# EAGLE board LRC (EAGLE 5.11)
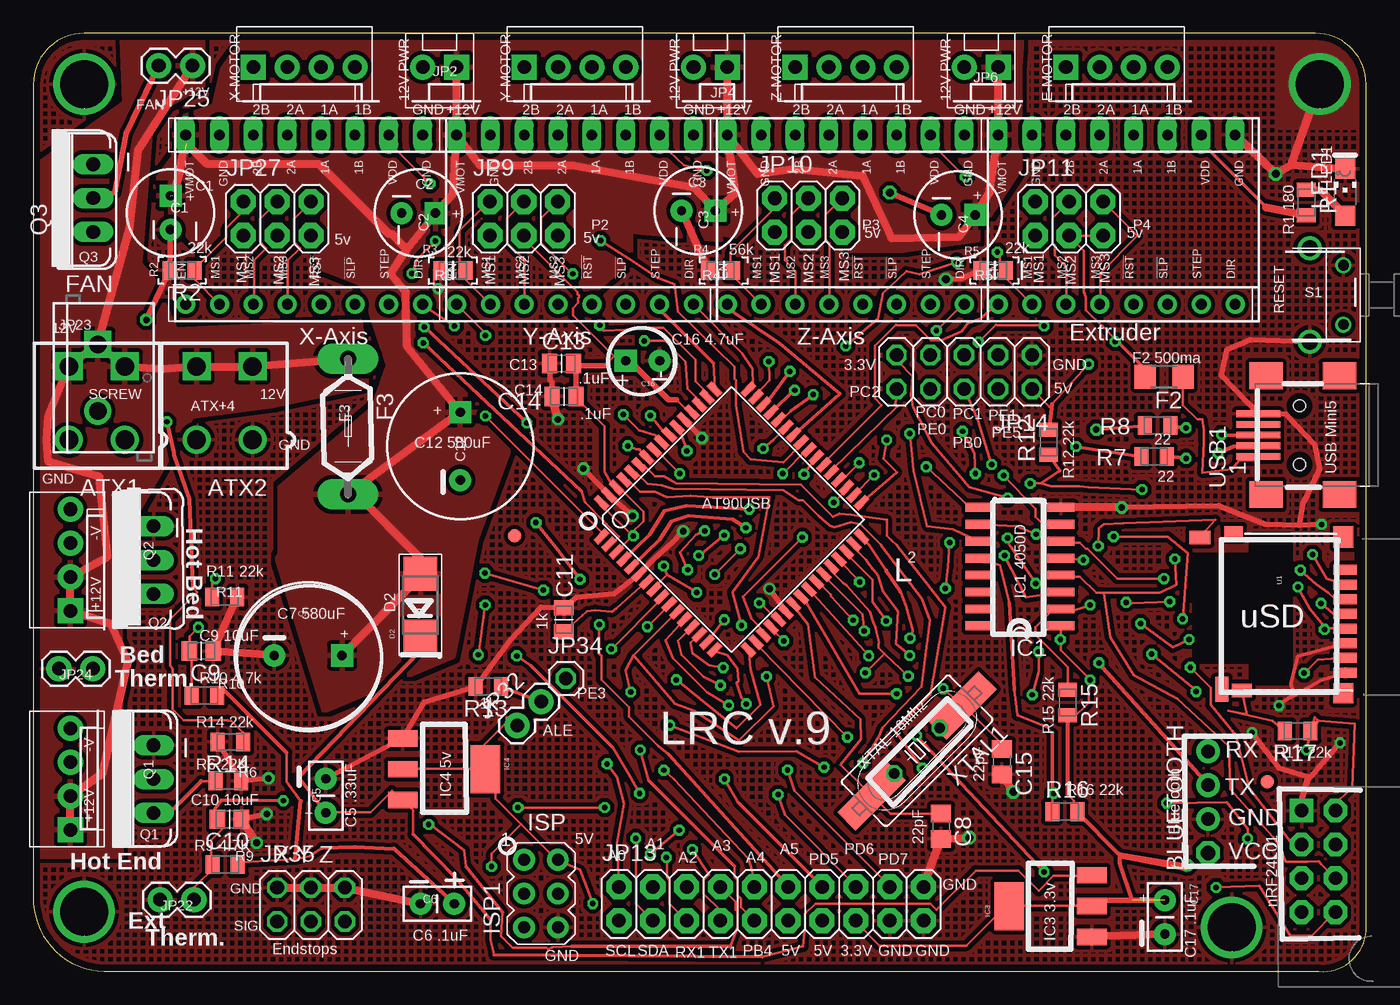
[diagram p1: board, top side]
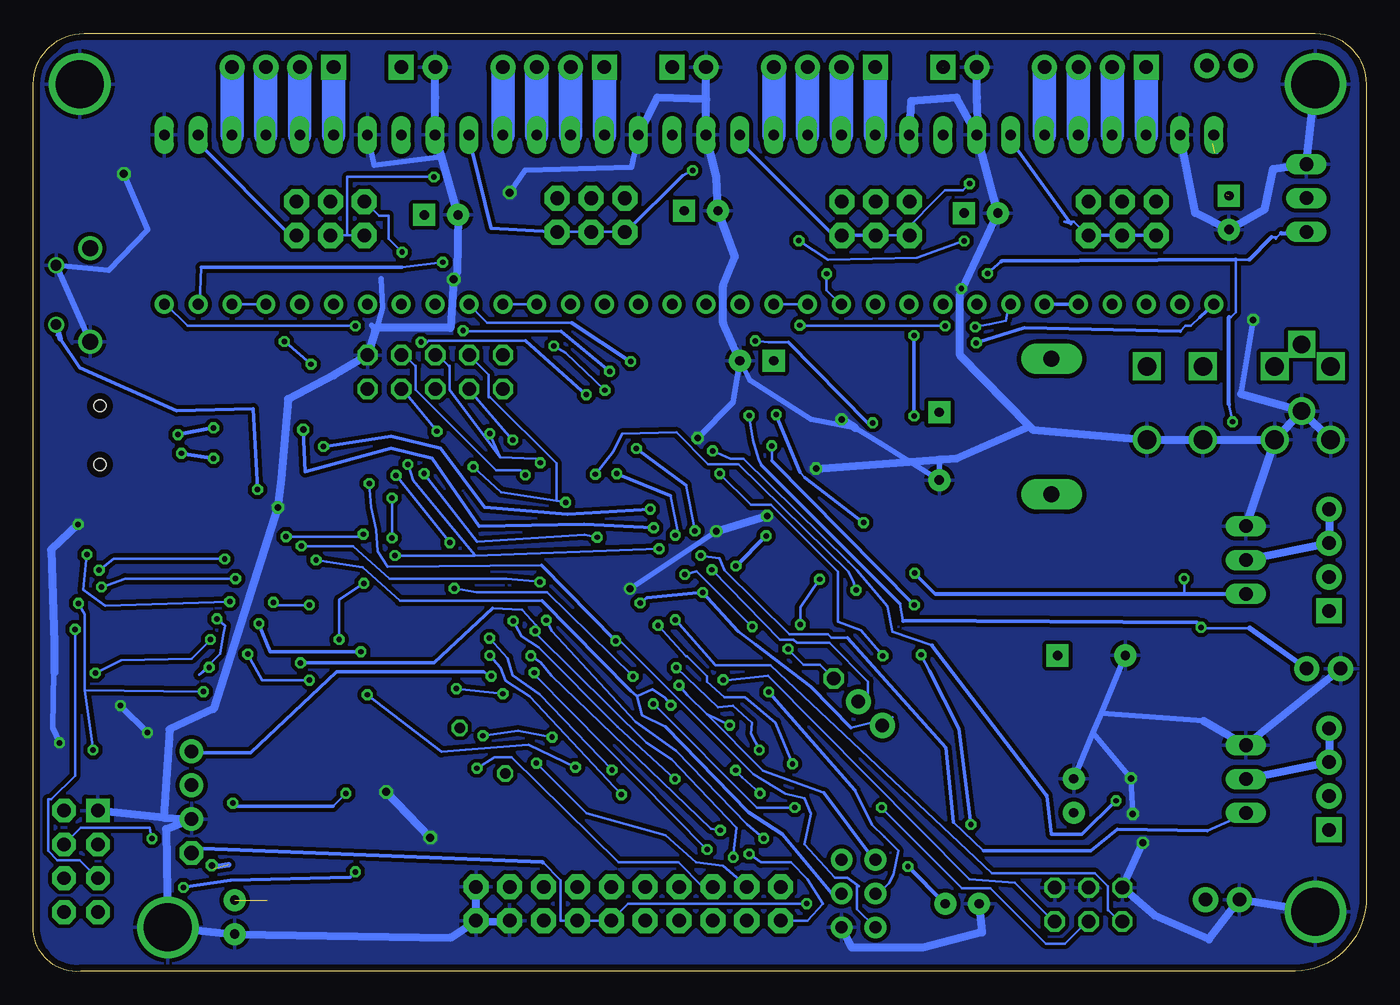
[diagram p2: board, bottom side, seen from below]

Size 100 x 70.37 mm. Coordinates in mm from the lower left corner, seen from the top.
Outline: 0,5.6 arc90 5.33,0.01 96.46,0.01 arc90 100,3.06 100,66.56 arc90 96.19,70.37 3.81,70.37 arc90 0,66.56 0,5.6
Copper layers (1*16): Top 0.0356mm / dielectric 1.5011mm / Bottom 0.0356mm
Design rules "LaenPCBOrder-LL-strict": minimum track width 8mil, minimum drill 16mil, track to track 8mil, track to pad 8mil, pad to pad 12mil, via to via 10mil, smd to smd 4mil, copper to edge 20mil, drill to drill 15mil, minimum pad ring 8mil, minimum via ring 8mil, stop-mask expansion 6mil, vias tented up to drill 25mil, thermal gap 12mil

## Footprints (pad centres in the part's own frame; a part is rotated, then mirrored left to right if it is on the bottom)
MINIFITJR-4-VERTICAL = drill 1.4 round: 1 2.1,-2.75; 2 -2.1,-2.75 | drill 1.4 square: 3 2.1,2.75; 4 -2.1,2.75
BLUETOOTH-BREAKOUT1X04 = drill 1.016 pad 1.778 round: GND 0,-1.27; RX 0,3.81; TX 0,1.27 | drill 1.1 pad 1.778 octagon: VCC 0,-3.81
CPOL-RADIAL-100UF-25V = drill 0.7 pad 1.651 square: 1 1.27,0 | drill 0.7 pad 1.651 round: 2 -1.27,0
CAP-PTH-SMALL2 = drill 0.7 pad 1.651 round: 1 0,0; 2 2.54,0
CPOL-RADIAL-1000UF-25V = drill 0.7 pad 1.651 square: 1 2.54,0 | drill 0.7 pad 1.651 round: 2 -2.54,0
C805 = smd 1.3 x 1.5: 1 -0.95,0; 2 0.95,0
CAPC2012X145AN = smd 1.15 x 1.45: 1 -0.9,0; 2 0.9,0
CPOL-RADIAL-10UF-25V = drill 0.7 pad 1.651 square: 1 1.27,0 | drill 0.7 pad 1.651 round: 2 -1.27,0
SMADIODE = smd 2.54 x 2.54: A 2.349,0; C -2.349,0
R1206 = smd 1.6 x 1.803: 1 -1.422,0; 2 1.422,0
LITTLEFUSE = drill 1.2 pad 2.3 long: 1 -5.08,0; 2 5.08,0
SO16 = smd 0.66 x 2.032: 1 -4.445,-3.073; 2 -3.175,-3.073; 3 -1.905,-3.073; 4 -0.635,-3.073; 5 0.635,-3.073; 6 1.905,-3.073; 7 3.175,-3.073; 8 4.445,-3.073; 9 4.445,3.073; 10 3.175,3.073; 11 1.905,3.073; 12 0.635,3.073; 13 -0.635,3.073; 14 -1.905,3.073; 15 -3.175,3.073; 16 -4.445,3.073
TQFP64-2 = smd 1.194 x 0.508: 1 -7.8,6; 2 -7.8,5.2; 3 -7.8,4.4; 4 -7.8,3.6; 5 -7.8,2.8; 6 -7.8,2; 7 -7.8,1.2; 8 -7.8,0.4; 9 -7.8,-0.4; 10 -7.8,-1.2; 11 -7.8,-2; 12 -7.8,-2.8; 13 -7.8,-3.6; 14 -7.8,-4.4; 15 -7.8,-5.2; 16 -7.8,-6; 33 7.8,-6; 34 7.8,-5.2; 35 7.8,-4.4; 36 7.8,-3.6; 37 7.8,-2.8; 38 7.8,-2; 39 7.8,-1.2; 40 7.8,-0.4; 41 7.8,0.4; 42 7.8,1.2; 43 7.8,2; 44 7.8,2.8; 45 7.8,3.6; 46 7.8,4.4; 47 7.8,5.2; 48 7.8,6 | smd 0.508 x 1.194: 17 -6,-7.8; 18 -5.2,-7.8; 19 -4.4,-7.8; 20 -3.6,-7.8; 21 -2.8,-7.8; 22 -2,-7.8; 23 -1.2,-7.8; 24 -0.4,-7.8; 25 0.4,-7.8; 26 1.2,-7.8; 27 2,-7.8; 28 2.8,-7.8; 29 3.6,-7.8; 30 4.4,-7.8; 31 5.2,-7.8; 32 6,-7.8; 49 6,7.8; 50 5.2,7.8; 51 4.4,7.8; 52 3.6,7.8; 53 2.8,7.8; 54 2,7.8; 55 1.2,7.8; 56 0.4,7.8; 57 -0.4,7.8; 58 -1.2,7.8; 59 -2,7.8; 60 -2.8,7.8; 61 -3.6,7.8; 62 -4.4,7.8; 63 -5.2,7.8; 64 -6,7.8
SOT223 = smd 1.219 x 2.235: 1 -2.311,-3.099; 2 0,-3.099; 3 2.311,-3.099 | smd 3.6 x 2.2: 4 0,3.099
AVRISP = drill 0.9 pad 1.626 round: 1 -1.27,2.54; 2 1.27,2.54; 3 -1.27,0; 4 1.27,0; 5 -1.27,-2.54; 6 1.27,-2.54
MOLEX-1X4 = drill 1.016 pad 1.88 square: 1 0,0 | drill 1.016 pad 1.88 round: 2 2.54,0; 3 5.08,0; 4 7.62,0
MOLEX-1X2 = drill 1.016 pad 1.88 square: 1 0,0 | drill 1.016 pad 1.88 round: 2 2.54,0
2X03 = drill 1.016 pad 1.88 octagon: 1 -2.54,-1.27; 2 -2.54,1.27; 3 0,-1.27; 4 0,1.27; 5 2.54,-1.27; 6 2.54,1.27
2X10 = drill 1.016 pad 1.88 octagon: 1 -11.43,-1.27; 2 -11.43,1.27; 3 -8.89,-1.27; 4 -8.89,1.27; 5 -6.35,-1.27; 6 -6.35,1.27; 7 -3.81,-1.27; 8 -3.81,1.27; 9 -1.27,-1.27; 10 -1.27,1.27; 11 1.27,-1.27; 12 1.27,1.27; 13 3.81,-1.27; 14 3.81,1.27; 15 6.35,-1.27; 16 6.35,1.27; 17 8.89,-1.27; 18 8.89,1.27; 19 11.43,-1.27; 20 11.43,1.27
2X05 = drill 1.016 octagon: 1 -5.08,-1.27; 2 -5.08,1.27; 3 -2.54,-1.27; 4 -2.54,1.27; 5 0,-1.27; 6 0,1.27; 7 2.54,-1.27; 8 2.54,1.27; 9 5.08,-1.27; 10 5.08,1.27
1X02 = drill 1.016 pad 1.88 round: 1 0,0; 2 2.54,0
SCREWTERMINAL-5MM-2 = drill 1.3 pad 2.032 square: 1 0,0 | drill 1.3 pad 2.032 round: 2 5,0
FIDUCIAL-1X2.5 = smd 1 x 1: 1 0,0
1X01 = drill 1.016 octagon: 1 0,0
2X03' = drill 1.016 octagon: 1 -2.54,-1.27; 2 -2.54,1.27; 3 0,-1.27; 4 0,1.27; 5 2.54,-1.27; 6 2.54,1.27
CHIPLED_1206 = smd 1.5 x 1.5: A 0,-1.75; C 0,1.75
POLOLU-ALLEGRO-PTH = drill 0.8 pad 1.422 long: 1A 6.35,-1.27; 1B 6.35,-3.81; 2A 6.35,1.27; 2B 6.35,3.81; GNDMOT 6.35,6.35; GNDVDD 6.35,-8.89; VDD 6.35,-6.35; VMOT 6.35,8.89 | drill 0.8 pad 1.422 round: !EN -6.35,8.89; !RST -6.35,-1.27; !SLP -6.35,-3.81; DIR -6.35,-8.89; MS1 -6.35,6.35; MS2 -6.35,3.81; MS3 -6.35,1.27; STEP -6.35,-6.35
TO220V = drill 1.016 long: 1 -2.54,0; 2 0,0; 3 2.54,0
RESC2012X70N = smd 1.05 x 1.4: 1 -0.95,0; 2 0.95,0
NRF24L01-BREAKOUT-ITEAD = drill 1 pad 1.778 octagon: CE 13.306,-3.056; CSN 10.766,-3.056; IRQ 10.766,2.024; MISO 13.306,2.024; MOSI 10.766,-0.516; SCK 13.306,-0.516; VCC 10.766,-5.596 | drill 1 pad 1.778 square: GND 13.306,-5.596
USD-SOCKET-PP = smd 0.75 x 1.75: 1-DAT2 7.65,-0.9; 2-CD 6.55,-0.9; 3-CMD 5.45,-0.9; 4-VDD 4.35,-0.9; 5-CLK 3.25,-0.9; 6-VSS 2.15,-0.9; 7-DAT0 1.05,-0.9; 8-DAT1 -0.05,-0.9 | smd 1 x 1.5: CD1 -1.4,6.85 | smd 1 x 1.6: CD2 10.075,10 | smd 1 x 1.4: GND1 10.425,7.475 | smd 1.6 x 1.5: GND2 10.125,-0.775 | smd 1.5 x 1.5: P$1 -1.6,-0.75 | smd 1.85 x 1: P$2 -1.3,8.35
PLATEDSCREW = drill 3.6 round: GND 0,0
FSMRACD = drill 1.2 round: GND1 0,3.81; GND2 6.985,3.81 | drill 0.8 round: P$1 1.27,1.27; P$2 5.715,1.27
CONN_USB_MINI-B = smd 2 x 2.5: BODY@1 -4.45,2.5; BODY@2 4.45,2.5; BODY@3 4.45,-3; BODY@4 -4.45,-3 | smd 0.5 x 3.3: D+ 0,3.1; D- -0.8,3.1; GND 1.6,3.1; ID 0.8,3.1; VUSB -1.6,3.1 | hole 0.9: -2.2,0; 2.2,0
HC-49U-OR-DIP = smd 5.334 x 1.93: 1 -4.826,0; 2 4.826,0 | drill 0.8 octagon: P$1 -2.413,0; P$2 2.413,0

## Placement (x,y rotation side)
ATX1  ATX-4VERTICAL  [MINIFITJR-4-VERTICAL]  4.77,42.64 0 top
ATX2  ATX-4VERTICAL  [MINIFITJR-4-VERTICAL]  14.35,42.64 0 top
BLUETOOTH  [BLUETOOTH-BREAKOUT1X04]  88.13,12.71 0 top
C1  100uf  [CPOL-RADIAL-100UF-25V]  10.3,56.91 90 top
C2  100uf  [CPOL-RADIAL-100UF-25V]  28.9,56.89 0 top
C3  100uf  [CPOL-RADIAL-100UF-25V]  49.9,57.07 0 top
C4  100uf  [CPOL-RADIAL-100UF-25V]  69.4,56.75 0 top
C5  0.33uF  [CAP-PTH-SMALL2]  21.95,11.92 90 top
C6  0.1uF  [CAP-PTH-SMALL2]  31.58,5.09 180 top
C7  580uF  [CPOL-RADIAL-1000UF-25V]  20.61,23.7 0 top
C8  22pf  [C805]  68.11,10.9 270 top
C9  10uF  [CAPC2012X145AN]  12.61,24.04 180 top
C10  10uF  [CAPC2012X145AN]  14.72,11.42 180 top
C11  1uf  [CAPC2012X145AN]  39.81,26.39 270 top
C12  580uF  [CPOL-RADIAL-1000UF-25V]  32.03,39.4 90 top
C13  0.1uF  [CAPC2012X145AN]  39.63,45.61 0 top
C14  0.1uF  [CAPC2012X145AN]  39.82,43.14 180 top
C15  22pf  [C805]  72.68,15.74 270 top
C16  4.7uF  [CPOL-RADIAL-10UF-25V]  45.72,45.81 180 top
C17  0.1uF  [CAP-PTH-SMALL2]  84.89,5.35 270 top
D2  [SMADIODE]  29.04,27.48 90 top
F2  500ma  [R1206]  84.83,44.62 180 top
F3  8A  [LITTLEFUSE]  23.61,40.88 270 top
IC1  4050D  [SO16]  74.03,30.37 90 top
IC2  AT90USB1286  [TQFP64-2]  52.38,33.9 45 top
IC3  3.3v  [SOT223]  76.31,4.91 90 top
IC4  5v  [SOT223]  30.82,15.18 270 top
ISP1  AVRISP-6  [AVRISP]  38.09,5.85 0 top
JP1  MOT-X  [MOLEX-1X4]  16.51,67.83 0 top
JP2  12VPWR  [MOLEX-1X2]  31.75,67.83 180 top
JP3  MOT-Y  [MOLEX-1X4]  36.83,67.83 0 top
JP4  12VPWR  [MOLEX-1X2]  52.07,67.83 180 top
JP5  MOT-Z  [MOLEX-1X4]  57.15,67.83 0 top
JP6  12VPWR  [MOLEX-1X2]  72.39,67.83 180 top
JP7  MOT-E  [MOLEX-1X4]  77.47,67.83 0 top
JP8  HOTEND  [MOLEX-1X4]  2.79,10.62 90 top
JP9  [2X03]  36.8,56.47 0 top
JP10  [2X03]  58.15,56.73 0 top
JP11  [2X03]  77.71,56.47 0 top
JP13  [2X10]  55.36,5.09 0 top
JP14  [2X05]  69.84,44.97 180 top
JP21  HOTBED  [MOLEX-1X4]  2.79,27.05 90 top
JP22  E-THERM  [1X02]  12.05,5.39 180 top
JP23  SCREW  [SCREWTERMINAL-5MM-2]  4.84,47.04 270 top
JP24  B-THERM  [1X02]  4.46,22.71 180 top
JP25  FAN  [1X02]  11.95,67.94 180 top
JP26  FIDUCIAL1X2.5  [FIDUCIAL-1X2.5]  36.09,32.7 0 top
JP27  [2X03]  18.3,56.47 0 top
JP32  ALE  [1X02]  36.3,18.45 45 top
JP33  FIDUCIAL1X2.5  [FIDUCIAL-1X2.5]  92.58,14.23 0 top
JP34  [1X01]  39.96,21.98 0 top
JP35  [2X03']  20.83,5.02 0 top
LED1  [CHIPLED_1206]  98.42,58.44 0 top
P1  POLOLU-X  [POLOLU-ALLEGRO-PTH]  20.32,56.4 90 top
P2  POLOLU-Y  [POLOLU-ALLEGRO-PTH]  40.64,56.4 90 top
P3  POLOLU-Z  [POLOLU-ALLEGRO-PTH]  60.96,56.4 90 top
P4  POLOLU-E  [POLOLU-ALLEGRO-PTH]  81.28,56.4 90 top
Q1  RFP30N06LE  [TO220V]  9.03,14.43 90 top
Q2  RFP30N06LE  [TO220V]  9.03,30.86 90 top
Q3  RFP30N06LE  [TO220V]  4.49,58.01 90 top
R1  180  [RESC2012X70N]  95.51,57.67 270 top
R2  22k  [RESC2012X70N]  11.17,52.59 180 top
R3  22k  [RESC2012X70N]  31.5,52.59 180 top
R4  22k  [RESC2012X70N]  51.56,52.59 180 top
R5  22k  [RESC2012X70N]  72.01,52.59 180 top
R6  22k  [RESC2012X70N]  14.64,14.31 0 top
R7  22  [RESC2012X70N]  84.08,38.62 180 top
R8  22  [RESC2012X70N]  84.34,40.94 180 top
R9  4.7k  [RESC2012X70N]  14.39,8.02 0 top
R10  4.7k  [RESC2012X70N]  12.84,20.7 0 top
R11  22k  [RESC2012X70N]  14.35,28.09 0 top
R12  22k  [RESC2012X70N]  76.18,39.69 90 top
R13  1k  [RESC2012X70N]  34.14,21.37 180 top
R14  22k  [RESC2012X70N]  14.78,17.22 180 top
R15  22K  [RESC2012X70N]  77.6,20.17 270 top
R16  22K  [RESC2012X70N]  77.39,11.99 0 top
R17  22K  [RESC2012X70N]  94.86,18.04 180 top
RF1  NRF24L01-BREAKOUT  [NRF24L01-BREAKOUT-ITEAD]  108.46,6.48 180 top
U1  USD-SOCKETUSD  [USD-SOCKET-PP]  97.52,22.48 90 top
U$8  PLATED-SCREW  [PLATEDSCREW]  89.91,3.31 0 top
U$9  FSMRACD  [FSMRACD]  99.56,47.25 90 top
U$11  [L2LOGO]  65.27,29.85 0 top
U$17  PLATED-SCREW  [PLATEDSCREW]  3.81,4.49 0 top
U$24  PLATED-SCREW  [PLATEDSCREW]  96.52,66.56 0 top
U$37  PLATED-SCREW  [PLATEDSCREW]  3.81,66.56 0 top
USB1  CON-USB-MINI-BUSB1  [CONN_USB_MINI-B]  94.99,40.23 90 top
XTAL1  16.000MHZ  [HC-49U-OR-DIP]  66.3,16.56 225 top

## Tracks (layer width: path | path; a pad name or v marks a point on that pad's centre or on a via)
3.3V  (via drill 0.41, 0.5 pad 0.81)  (2 unrouted)
  Top 0.203: 79.7,5.34 79.39,5.04 IC3.2 79.39,4.94 73.25,4.94 IC3.4 73.14,4.89 73.04,4.99 69.99,1.94 63.49,1.94 61.71,3.72 JP13.15 | 84.88,5.34 C17.1 | RF1.VCC 97.68,12.1 97.43,12.35 98.95,13.8 99.13,18.58 96.46,18.8 R17.1 96.36,18.86 96.16,19.06 v95.52,16.62 | v96.61,27.62 97.53,26.83 98.39,26.83 U1.4-VDD | 77.61,13.27 78.07,12.81 78.07,12.25 78.33,12 R16.2 78.38,11.9 | 77.61,19.21 R15.2 77.72,19.21 77.97,18.96 79.19,20.18 79.19,21.85 | 77.11,24.9 77.11,24.09 79.19,22 79.19,21.85 | 77.11,24.9 77.11,25.92 IC1.1 | JP14.9 64.89,45.73 65.96,44.66 65.83,43.24 65.98,42.38 67.43,39.63 70.22,36.33 v73.09,35.52 | v73.09,32.52 73.09,32.24 v75.2,29.12 | 77.11,24.9 v77.06,24.9 | v87.24,20.99 87.37,20.99 v83.91,23.81 | 79.19,21.85 v79.29,21.85
  Top 0.305: 77.61,13.27 77.61,19.21 | 78.38,11.9 81.42,8.85 v86.61,7.96 | 82.44,5.34 81.53,8.14 81.53,8.64 86.52,7.67
  Top 0.406: 79.7,5.34 84.88,5.34 | 86.52,7.67 85.59,8.01
  Bottom 0.203: v96.61,27.62 96.16,26.78 96.16,21.12 | 96.16,21.12 v95.52,16.62 | v73.09,32.52 v73.09,35.52 | v75.2,29.12 77.06,27.9 v77.06,24.9 | v83.91,23.81 82.85,21.85 v79.29,21.85 | v87.24,20.99 96.16,21.12
  Bottom 0.406: v86.61,7.96 86.1,7.88 85.34,8.01
5V  (via drill 0.41)
  Top 0.203: 88.13,62.29 87.67,62.75 P4.VDD | 67.35,62.19 67.35,62.75 P3.VDD | P1.VDD 26.71,62.7 26.71,62.14 v29.76,59.09 | 46.98,62.19 P2.VDD | P2.VDD 47.03,62.14 | P3.VDD 67.4,62.04 | P4.VDD 87.83,62.49 | P3.VDD 67.51,62.04 | P2.VDD 46.98,62.09 | P2.VDD 47.08,62.09 | P3.VDD 67.35,61.98 | P4.VDD 87.83,62.39 | P3.VDD 67.56,61.98 | 13.81,21.29 13.81,20.73 R10.2 13.86,21.19 14.22,21.19 | 87.83,61.98 87.83,62.29 P4.VDD | 67.35,61.83 67.35,61.88 P3.VDD | 20.06,12.78 18.99,14.23 18.99,16.42 | R9.2 15.23,8.7 15.59,8.19 19.65,8.44 20.72,8.64 21.66,9.28 | IC4.2 27.73,15.2 33.88,15.2 IC4.4 | 36.59,11.06 34.69,12.96 34.69,14.38 33.98,15.1 IC4.4 | 36.59,11.06 39.26,8.39 ISP1.2 39.36,8.34 41.01,7.63 v41.98,5.09 | v34.38,7.88 34.38,8.85 36.59,11.06 | JP32.1 35.5,19.06 35.5,18.7 32.96,16.16 33.88,15.25 IC4.4 | C6.1 | P4.VDD 87.88,61.93 | JP14.2 76.24,42.38 76.43,42.57 v79.16,45.55 | 83.41,45.22 83.41,44.66 F2.2 | JP11.5 80.2,55.18 77.82,55.18 JP11.3 77.72,55.18 78.83,54.06 78.83,50.91 78.88,50.86 78.88,50.71 78.99,50.61 78.99,49.59 80.15,48.42 80.2,48.42 81.27,47.35 v81.17,47.25 | 44.8,32.52 44.95,32.67 44.8,32.83 | 44.8,32.52 43.78,31.5 IC2.3 | 44.8,32.83 42.87,34.76 42.87,34.96 42.66,35.16 IC2.64 | 47.54,29.78 46.63,28.86 46.63,28.71 IC2.8 | 47.54,29.78 v47.29,30.41 | v45.03,32.67 44.8,32.52 | 44.8,32.83 45.76,33.79 45.76,34.5 43.98,36.28 43.78,36.28 IC2.62 43.73,36.38 43.35,36.64 42.87,37.5 42.87,40.9 40.73,43.04 C14.1 40.73,43.19 | v54.47,27.64 55.69,26.55 55.87,26.42 IC2.21 | v49.78,28.43 47.54,29.78 | 40.73,45.37 40.53,45.58 C13.2 40.78,45.42 | 48.25,42.88 49.17,41.97 49.37,41.97 IC2.52 | 44.49,46.03 C16.1 44.39,46.13 43.98,46.54 43.58,46.13
  Top 0.203: 42.87,45.42 43.58,46.13 | JP9.3 36.82,55.18 37.28,54.72 37.28,54.52 40.84,50.96 40.84,50.81 40.94,50.71 40.94,50.55 40.89,50.5 40.89,50.15 40.48,49.74 40.48,49.23 43.58,46.13 | v50.54,60.08 48.84,60.46 47.13,62.04 P2.VDD | v69.94,59.6 69.89,59.6 67.56,61.93 P3.VDD
  Top 0.254: 87.88,61.93 92.5,57.31 | 81.27,47.35 83.41,45.22
  Top 0.305: 19.65,8.44 20.06,12.78 | 18.99,16.42 14.22,21.19 | 21.66,9.28 24.12,9.36 27.07,9.23 C6.1 | 76.43,42.57 R12.2
  Top 0.406: 40.73,43.19 40.73,45.37 | 48.25,42.88 47.64,42.88 44.49,46.03 | 40.78,45.42 42.87,45.42
  Top 0.61: 92.5,57.31 R1.2
  Bottom 0.203: P4.VDD 87.68,62.7 | 46.94,62.39 46.94,62.7 P2.VDD | P2.VDD 46.94,62.29 | P2.VDD 46.84,62.29 | 47.14,62.29 47.04,62.29 P2.VDD | P2.VDD 46.79,62.24 | P2.VDD 47.19,62.24 | P4.VDD 87.63,62.44 | P4.VDD 87.57,62.39 | P4.VDD 87.57,62.29 | P3.VDD 67.25,62.7 67.25,61.43 67.05,61.43 | P4.VDD 87.57,62.19 | P2.VDD 46.78,62.14 | 26.21,61.68 26.21,62.75 P1.VDD 26.15,61.63 | 61.77,8.19 60.44,6.87 60.44,3.82 JP13.13 JP13.11 55.36,5.09 v41.98,5.09 | 88.13,8.75 BLUETOOTH.VCC | C6.1 | 76.45,55.23 77.67,55.23 JP11.3 | 76.45,55.23 75.18,55.23 JP11.1 | v79.16,45.55 81.12,47.25 v81.17,47.25 | 80.71,55.23 80.26,55.23 JP11.5 | 87.57,62.09 P4.VDD | 53.94,28.05 v54.47,27.64 | 61.1,55.48 60.7,55.48 JP10.5 60.6,55.48 58.21,55.48 JP10.3 58.11,55.48 55.62,55.48 JP10.1 55.52,55.48 | 15.79,55.23 JP27.1 | 18.28,55.23 JP27.3 18.38,55.23 | 22.14,56.09 22.65,56.24 21.94,56.24 20.92,55.23 20.87,55.23 JP27.5 20.77,55.23 | 39.97,55.23 39.36,55.23 JP9.5 39.26,55.23 | 46.78,62.04 P2.VDD | 36.87,55.23 JP9.3 36.77,55.23 34.28,55.23 JP9.1 34.89,55.28 31.59,58.58 30.27,58.58 v29.76,59.09 | v50.54,60.08 51.3,59.7 | v69.94,59.6 76.45,59.6 76.45,55.23 | 38.65,18.3 35.55,19.06 JP32.1 | 45.76,24.52 47.13,25.54
  Bottom 0.254: 87.32,9.2 88.13,8.75 | 80.71,55.23 87.57,62.09 | 53.94,28.05 v49.78,28.43 47.13,25.54 | 61.1,55.48 65.65,55.76 67.05,61.43 | 18.28,55.23 15.79,55.23 | 26.15,61.63 22.14,56.09 | 20.77,55.23 18.38,55.23 | 39.97,55.23 46.78,62.04 | 36.87,55.23 39.26,55.23 | 51.3,59.7 55.52,55.48 | 38.65,18.3 41.65,21.34 45.76,24.52
  Bottom 0.305: 61.77,8.19 87.32,9.2 | C6.1 v34.38,7.88 | v47.29,30.41 v45.03,32.67
12V
  Top 0.203: 16.4,45.37 ATX2.3 | ATX2.4 12.54,45.37
  Top 0.61: JP23.1 ATX1.4 1.14,41.66 1.01,39.89 1.14,38.24 4.95,37.09 5.58,31.12 JP21.2 JP21.1 5.83,26.04 7.1,23.25 5.2,14.87 JP8.2 JP8.1 | JP23.1 ATX1.3 9.64,45.22 11.68,45.35 ATX2.4 | JP23.1 7.23,55.76 7.87,61.6 JP25.1 | 12.54,45.37 16.4,45.37 | ATX2.3 F3.1
  pour Top (isolate 0.305): -0.26,8.64 6.6,8.64 6.47,32.14 11.93,41.66 17.9,42.43 25.01,43.95 24.5,48.78 10.66,48.14 8.88,52.08 7.99,53.09 8.88,64.27 12.69,66.43 12.69,71.64 6.6,71.89 6.85,65.16 0.25,60.46
!E-ENABLE
  Top 0.203: IC2.38 59.33,38.01 59.33,38.16 63.64,42.48 63.14,42.99 63.14,46.95 64.71,48.52 64.76,48.47 66.21,48.47 67.33,47.35 68.12,47.35 69.66,48.01 70.1,48.6 71.09,48.98 72.33,50.1 P4.!EN
!HOTBED  (via drill 0.41)
  Top 0.203: R11.1 13.4,28.1 13.4,29.22 v13.66,29.47 | v57.83,37.3 58.59,38.44 58.72,38.57 IC2.39 | v33.88,29.88 v38.27,28.61
  Bottom 0.203: v57.83,37.3 56.48,39.02 55.85,40.32 51.76,40.45 49.37,38.06 47.08,38.06 38.85,29.98 38.47,29.24 v38.27,28.61 | Q2.1 9.03,28.3 | 13.66,28.3 v13.66,29.47
  Bottom 0.254: 32.3,28.3 v33.88,29.88
  Bottom 0.305: 9.03,28.3 13.66,28.3 32.3,28.3
!HOTEND  (via drill 0.41)
  Top 0.203: v56.23,37.35 58.01,39.12 58.16,39.12 IC2.40 | v49.93,31.2 v51.83,32.72 | 12.59,14.28 13.66,14.28 R6.1 | 9.59,11.29 9.03,11.84 Q1.1
  Top 0.305: 9.59,11.29 12.59,14.28
  Bottom 0.203: 52.19,35.7 51.6,32.72 v51.83,32.72 | v49.93,31.2 48.51,31 48.12,30.11 43.27,25.31 40.38,25.31 40.12,25.05 38.9,25.05 | 28.72,9.08 30.98,11.18 | 11.93,10.57 9.03,11.84 Q1.1
  Bottom 0.254: 52.19,35.7 v56.23,37.35 | 38.9,25.05 31.51,16.77 30.98,11.18 | 28.72,9.08 20.67,9.08 18.66,10.68 11.93,10.57
!PWM-FAN  (via drill 0.41)
  Top 0.203: v42.56,54.82 44.7,53.45 46.83,52.05 48.1,51.55 48.35,49.49 52.62,45.35 52.62,44.46 52.72,44.36 52.72,42.48 53.28,39 53.79,38.41 56.28,38.21 57.6,39.53 57.6,39.68 IC2.41 | v30.17,54.8 28.75,53.37 28.49,52.54 v28.41,52.36 | 11.98,28.76 12.29,28.46 10.25,26.42 10.25,22.92 10.46,22.72 10.46,19.67 11.27,18.86 14.57,18.86 14.62,18.8 14.83,18.8 15.69,17.94 15.69,17.23 R14.1 | 10.56,38.77 10.56,38.92
  Top 0.305: 11.98,28.76 11.73,35.44 10.56,38.77 | 10.56,38.92 v10.03,41.23
  Bottom 0.203: 6.75,55.02 6.39,55.38 | 6.75,55.02 6.8,54.97 | 5.99,55.38 5.88,55.48 4.51,55.48 Q3.1 | v42.56,54.82 40.38,53.4 33.72,53.53 v30.17,54.8 | 27.37,53.27 v28.41,52.36 | 8.78,53.4 9.8,53.4 9.8,49.44 10.15,49.08 10.3,49.08 | 7.1,55.08 6.8,55.08 6.75,55.02 | v10.03,41.23 10.3,42.53
  Bottom 0.305: 6.39,55.38 5.99,55.38 | 9.8,53.4 27.37,53.27 | 8.78,53.4 7.1,55.08 | 10.3,42.53 10.3,49.08
!RESET  (via drill 0.41)
  Top 0.203: v56.3,24.8 55.54,25.56 55.36,25.81 IC2.20 | 75.58,36.64 77.01,37.55 | v74.8,36.61 75.58,36.64 | v83.18,36.15 79.16,36.33 78.48,36.38 76.34,36.38 75.58,36.64
  Top 0.254: 77.01,37.55 R12.1
  Bottom 0.203: 61.87,30.49 73.42,30.36 74.16,31.5 74.29,33.13 74.67,34.81 v74.8,36.61 | ISP1.5 38.19,4.68 38.19,6.41 38.04,6.41 38.9,7.02 39.87,7.02 42.16,9.56 41.65,11.82 42.16,13.01 43.55,13.34 45.97,14.79 56.18,25 56.38,25 v56.3,24.8 | 97.98,47.46 98.24,47.71
  Bottom 0.254: v56.3,24.8 61.87,30.49 | 97.98,47.46 96.54,45.3 89.25,42.07 83.51,42.2 v83.18,36.15
  Bottom 0.406: 97.98,47.46 U$9.P$1
!X-ENABLE  (via drill 0.41)
  Top 0.203: 41.14,36.03 41.39,35.19 42.79,33.79 43.02,33.54 43.93,32.62 43.48,32.16 43.22,32.06 IC2.2
  Top 0.254: v29.25,47.15 41.14,36.03
  Bottom 0.203: 12.49,49.08 13.15,48.42 13.56,48.42 13.96,48.01 | 29.02,47.25 v29.25,47.15
  Bottom 0.254: 13.96,48.01 25.65,48.27 29.02,47.25 | P1.!EN 12.49,49.08
!Y-ENABLE  (via drill 0.41)
  Top 0.203: v33.93,41.66 42.66,32.93 42.66,32.67 IC2.1 | v33.93,47.71 33.93,47.86 P2.!EN
  Bottom 0.254: v33.93,41.66 v33.93,47.71
!Z-ENABLE
  Top 0.203: 52.42,49.54 52.42,49.74 52.11,50.05 P3.!EN | IC2.42 57.09,40.29
  Top 0.254: 57.09,40.29 60.52,43.34 56,47.13 52.42,49.54
A0  (via drill 0.41)
  Top 0.203: v53.13,25.97 52.44,28.46 54.4,31.12 55.24,35.57 50.79,35.57 49.32,35.7 47.54,35.57 46.63,35.97 45.51,35.97 44.64,36.84 44.34,36.84 IC2.61 | JP13.2 43.81,9.66 44.31,12.58 43.81,14.56 v43.04,15.58
  Bottom 0.203: v53.13,25.97 51.05,23.63 50.94,23.63 49.47,22.16 49.47,21.75 48.12,20.58 46.6,20.58 44.31,18.68 v43.04,15.58
A1  (via drill 0.41)
  Top 0.203: v62.25,15.63 63.47,17.71 63.72,18.3 66.64,21.34 67.28,26.35 66.67,27.95 63.72,31.81 63.59,32.01 62.07,33.54 62.02,33.54 61.33,33.71 60.11,33.33 59.76,33.43 58.92,34.2 57.75,35.37 57.4,35.37 56.28,36.1 48,36.23 47.13,36.46 46.07,36.58 45.25,37.4 44.9,37.4 IC2.60
  Bottom 0.203: v62.25,15.63 58.49,11.87 52.57,10.22 50.28,8.19 48.25,7.93 46.47,6.41 JP13.4
A2  (via drill 0.41)
  Top 0.203: v66.72,15.25 64.64,18.04 65.27,18.73 67.3,20.76 68.45,27.31 64.76,32.01 64.38,32.34 64.03,32.7 64.03,33.87 61.33,34.25 60.47,34.35 60.01,34.1 57.6,36.51 48.2,36.64 47.31,37.14 46.63,37.14 45.81,37.96 45.46,37.96 IC2.59
  Bottom 0.203: v66.72,15.25 65.4,16.09 64.1,16.09 56.07,8.19 51.6,8.19 49.78,6.36 JP13.6
A3  (via drill 0.41)
  Top 0.203: v44.59,39.43 45.23,39.18 45.48,39.18 45.79,38.62 45.97,38.62 IC2.58 | v33.39,23.76 v33.9,27.49 | v29.66,11.03 29.66,11.13 32.33,9.1 32.45,7.86 | 35.22,4.45 35.09,2.65 35.96,1.79 38.5,1.79 38.6,1.68 38.96,1.81 40.38,1.91 | 52.32,1.91 52.82,3.31 52.82,4.48 52.67,4.63 52.67,5.24 JP13.8
  Top 0.254: 35.22,4.45 32.45,7.86 | 40.38,1.91 52.32,1.91
  Bottom 0.203: 44.59,38.31 v44.59,39.43 | 32.76,22.56 v33.39,23.76
  Bottom 0.254: v33.9,27.49 44.59,38.31 | 32.76,22.56 30.55,18.19 v29.66,11.03
A4  (via drill 0.41)
  Top 0.203: v48.51,37.35 46.73,39.12 46.63,39.12 IC2.57 | 37.35,22.92 v36.26,23.68 | 43.5,16.77 44.64,14.84 v45.48,13.37 | v47.31,15.1 48.07,14.44 53.66,8.47 53.92,7.6 54.09,6.41 JP13.10
  Top 0.254: 43.5,16.77 37.35,22.92
  Bottom 0.203: v48.51,37.35 46.17,35.01 44.64,35.01 39.62,29.98 39.62,26.22 37.91,25.59 v36.26,23.68 | v45.48,13.37 46.83,14.59 v47.31,15.1
A5  (via drill 0.41)
  Top 0.203: v44.26,41.77 45.43,40.6 46.68,40.22 46.91,39.99 47.13,39.73 IC2.56 | v42.46,26.02 42.46,23.83 42.61,23.68 42.61,21.9 44.7,19.82 44.7,19.11 46.88,16.92 47.64,16.29 | JP13.12 56.63,6.41
  Top 0.254: v37.71,33.66 39.36,31.58 v41.01,29.42 | 56.63,6.41 47.64,16.29
  Bottom 0.203: 42.1,37.04 42.49,37.45 | v41.01,29.42 42.46,27.34 v42.46,26.02
  Bottom 0.254: 42.49,37.45 v44.26,41.77 | v37.71,33.66 42.1,37.04
ALE  (via drill 0.41)
  Top 0.203: v54.75,39.23 55.57,39.94 56.43,40.8 IC2.43 | v50.36,33.05 49.72,32.77 48.53,31.45 v49.09,30.13
  Top 0.254: R13.1 JP32.2
  Bottom 0.203: v50.36,33.05 51.05,36.46 | v49.09,30.13 43.98,24.9 42.97,24.9 42.71,24.65 40.28,24.65 37.38,21.75 37.38,20.89 JP32.2
  Bottom 0.254: 51.05,36.46 v54.75,39.23
B-THERM  (via drill 0.41)
  Top 0.203: v46.3,41.69 47.44,40.29 47.69,40.29 IC2.55 | v12.39,25.81 11.73,25.15 11.73,24.09 C9.2 11.78,23.99 11.88,23.88 11.88,20.73 R10.1
  Bottom 0.203: v46.3,41.69 45.99,39.86 45.61,38.46 45.36,37.96 | 34.74,26.3 34.99,27.59 | 12.74,26.17 v12.39,25.81 12.34,25.76 8.73,25.76
  Bottom 0.254: 34.99,27.59 45.36,37.96
  Bottom 0.305: 12.74,26.17 34.74,26.3
  Bottom 0.406: JP24.1 8.73,25.76
E-DIR  (via drill 0.41)
  Top 0.203: 56.84,42.07 56.18,41.41 55.92,41.41 IC2.44 | v70.91,47.2 72.23,48.52 72.28,48.47 75.79,48.47 v75.84,48.42
  Top 0.254: 56.84,42.07 v58.51,43.26
  Bottom 0.203: 63.09,47.3 70.35,47.3 70.45,47.2 v70.91,47.2 | v75.84,48.42 88.44,48.42 90.06,50.05 P4.DIR
  Bottom 0.254: v58.51,43.26 63.09,47.3
E-MOT-1A
  Bottom 1.778: P4.1A JP7.3
E-MOT-1B
  Bottom 1.778: P4.1B JP7.4
E-MOT-2A
  Bottom 1.778: P4.2A JP7.2
E-MOT-2B
  Bottom 1.778: P4.2B JP7.1
E-MS1  (via drill 0.41)
  Top 0.203: P4.MS1 72.59,52.38 72.59,52.59 R5.1 72.53,52.64 72.53,53.75 v72.33,53.96
  Bottom 0.203: v72.33,53.96 73.35,54.97 73.35,56.7 74.06,56.7 75.07,57.72 75.12,57.72 JP11.2
E-MS2
  Top 0.203: P4.MS2 77.51,50.05 77.51,52.84 76.65,53.7 76.65,54.47 76.45,54.67 76.45,56.5 77.67,57.72 JP11.4
E-MS3
  Top 0.203: P4.MS3 80.05,50.05 80.05,52.38 82.85,55.18 80.26,57.77 JP11.6
E-RESETSLEEP
  Bottom 0.203: P4.!RST P4.!SLP
E-STEP  (via drill 0.41)
  Top 0.203: v60.95,46.92 63.36,48.95 63.75,50.88 65.5,52.51 66.46,52.31 v69.28,53.2 | IC2.45 55.36,41.97
  Top 0.254: 55.36,41.97 v57.12,43.59
  Bottom 0.203: v57.12,43.59 60.06,46.41 v60.95,46.92 | v69.28,53.2 72.33,52.82 | 87.42,52.82 87.52,50.05 P4.STEP
  Bottom 0.254: 72.33,52.82 87.42,52.82
E-THERM  (via drill 0.41)
  Top 0.203: v49.04,39.05 48.66,40.14 48.56,40.62 48.3,40.8 IC2.54 | 13.4,11.9 13.86,11.44 C10.2 13.81,11.34 14.32,10.83 13.35,9.86 13.35,8.7 R9.1 13.35,8.59 13.71,8.24 13.71,8.03 13.76,7.98 12.08,6.31 12.08,5.39 JP22.1
  Top 0.254: v18.76,12.81 16.88,12.84 14.09,12.84 13.4,11.9
  Bottom 0.203: v49.04,39.05 47.69,38.46 46.73,38.46 38.85,30.72 38.22,30.08 35.91,27.39 35.53,25.48 32.58,24.47
  Bottom 0.254: 23.97,13.19 23.61,10.3 21.33,10.3 v18.76,12.81
  Bottom 0.305: 23.97,13.19 32.58,24.47
GND  (via drill 0.41, 0.5, 0.6)
  Top 0.203: v30.37,51.21 30.07,51.52 30.07,52.59 R3.2 | 38.75,45.53 38.7,45.58 C13.1 | 38.9,44.2 38.75,44.36 | 38.9,43.24 38.96,43.19 C14.2
  Top 0.254: U1.6-VSS 94.86,23.63 94.35,21.6 94.61,20.84 93.52,20.1 | v93.46,19.95 93.52,20.1 | U1.8-DAT1 96.64,21.85 93.52,20.1
  Top 0.406: C5.2 IC4.1 29.33,20.2 R13.2 35.81,24.9 38.09,27.31 C11.1 40.76,28.08 43.55,28.33 IC2.6 46.6,31 47.87,32.14 v48.76,33.03 | v55.24,28.71 IC2.22 | v50.16,40.01 IC2.53 | v44.95,34.17 IC2.63 v41.27,37.73 | 38.75,44.36 38.75,45.53 | 38.9,43.24 38.9,44.2 | C10.1 v17.52,11.82 | v17.64,14.49 R6.2 R14.2 | v8.48,48.88 R2.2 C1.2 | v81.65,34.81 88.89,34.93 92.45,33.54 94.97,33.46 | R5.2 69.59,51.95 v68.45,51.92 | v64.25,58.43 C4.2 | v98.04,17.15 95.62,14.36 95.12,12.84 95.62,14.61 93.46,15.25 v91.43,17.92 | 94.97,33.46 v96.64,33.54 | 94.97,33.46 95.24,35.06 96.51,37.73 96.13,39.51 93.97,41.79 USB1.GND 89.15,44.71 89.53,46.62 91.31,47.38 U$9.GND1
  Top 0.61: v81.65,34.81 IC1.8 | C3.2 R4.2 | v73.53,13.47 C15.2 | v70.22,10.04 C8.2 JP13.20 | C6.2 JP35.6 JP35.4 JP35.2 | v16.76,9.66 C10.1 | v39.36,41.41 C14.2 | 94.39,60.53 LED1.C | C7.2 C9.1 R11.2 | C17.2 IC3.1 | 94.39,60.53 v93.21,59.83 P4.GNDVDD | 94.39,60.53 U$24.GND
  Bottom 0.203: 30.3,51.18 v30.37,51.21
  Bottom 0.406: 20.49,17.93 C5.2 | 20.49,17.93 19.88,19.39 | 19.88,19.39 C7.2 | v48.76,33.03 v55.24,28.71 | v50.16,40.01 47.49,42.68 C16.2 46.22,44.33 41.65,41.41 38.35,40.78 36.46,39.61 C12.2 32.03,38.49 30.73,38.49 | v17.52,11.82 v17.64,14.49 20.49,17.93 | 19.88,19.39 12.18,18.8 | 9.39,43.32 v8.48,48.88 | v93.21,59.83 91.43,55.63 94.35,52.59 U$9.P$2 U$9.GND1 | v68.45,51.92 68.44,52.07 | 74.29,48.01 74.62,48.47 | 74.29,48.01 73.78,49.79 73.91,51.95 | P4.GNDMOT 74.41,60.46 69.38,61.1 | v64.25,58.43 63.11,60.08 55.11,60.33 P3.GNDMOT | U1.6-VSS 98.54,18.3 v98.04,17.15 | v91.43,17.92 v93.46,19.95 | 74.36,48.04 74.29,48.01
  Bottom 0.61: 49.53,65.41 P2.GNDVDD 48.76,59.57 C3.2 47.36,53.6 48.25,51.44 48.25,48.65 C16.2 | 49.53,65.41 JP4.2 | JP23.2 ATX1.2 | ATX1.1 JP23.2 | ATX1.1 ATX2.2 ATX2.1 25.01,40.65 25.26,40.88 | ATX1.1 Q2.3 | U$37.GND Q3.3 6.98,60.21 7.61,57.16 C1.2 12.82,56.9 P1.GNDMOT | JP23.2 9.39,43.32 | JP24.2 Q1.3 12.18,18.8 | U$17.GND JP22.2 11.8,2.42 15.87,4.2 JP35.2 v16.76,9.66 | P1.GNDVDD 29.05,62.15 29.2,65.54 JP2.2 | JP6.2 69.84,65.54 P3.GNDVDD 69.38,61.1 C4.2 68.19,52.46 v68.45,51.92 68.7,48.27 74.29,48.27 74.36,48.04 JP14.1 77.46,44.71 80.89,42.93 81.4,36.97 v81.65,34.81 86.48,19.69 89.78,18.17 90.23,11.54 | JP13.19 68.7,2.55 C17.2 U$8.GND 90.04,10.68 BLUETOOTH.GND 90.23,11.54 | JP13.17 64,3.69 JP13.19 | JP13.19 JP13.20 | 90.23,11.54 RF1.GND | P1.GNDVDD C2.2 30.3,51.18 30.47,50.81 30.47,46.24 25.26,40.88 | v48.76,33.03 v44.95,34.17 | v41.27,37.73 30.73,38.49 25.26,40.88 | v70.22,10.04 v73.53,13.47 | ISP1.6 38.6,1.79 33.27,1.79 28.82,2.93 C6.2 | 38.35,40.78 v39.36,41.41 | P3.GNDMOT 53.2,65.54 49.53,65.41 | v96.64,33.54 98.67,31.63 U1.6-VSS U1.8-DAT1 | P1.GNDVDD 30.73,65.54 34.15,65.29 P2.GNDMOT
  pour Top (isolate 0.305, rank 6, hatched): 1.14,69.22 3.55,70.24 96.51,70.37 100.01,67.16 99.94,3.06 99.05,0.9 96.87,0.03 4.95,0.01 1.77,1.53 0,4.71 -0.01,67.19
  pour Bottom (isolate 0.305, rank 6): 0,67.19 1.39,69.35 3.55,70.24 96.64,70.37 99.95,67.19 99.94,3.06 99.05,1.02 96.9,0.01 4.95,0.01 1.77,1.53 0,4.71
  pour Top (isolate 0.254, rank 2, no thermals): 93.47,70.11 93.47,63.25 99.82,63.25 99.82,70.11
HOTBED-GND
  Bottom 0.61: Q2.2 JP21.3 JP21.4
HOTEND-GND
  Bottom 0.61: Q1.2 JP8.3 JP8.4
MISO  (via drill 0.41)
  Top 0.203: v51.55,21.47 50.28,22.11 48.63,23.76 48.35,24.8 49.37,25.81 IC2.13 | v95.34,22.39 96.39,23.38 98.39,23.53 U1.7-DAT0 | v86.71,24.9 85.49,24.32 v83.08,26.09 | v75.43,23.99 75.43,22.51 v74.95,20.76 | v59.33,15.32 57.27,16.52 52.93,16.47 v47.74,18.47
  Bottom 0.203: v51.55,21.47 50.92,20.73 49.47,19.29 | 49.47,19.29 45.25,15.07 40.68,13.42 | ISP1.1 36.92,8.39 | v95.34,22.39 93.39,23.35 88.13,23.48 v86.71,24.9 | v74.95,20.76 69.39,16.47 67.56,16.65 62.86,17.03 v59.33,15.32 | 49.47,19.29 v47.74,18.47
  Bottom 0.254: 36.92,8.39 40.68,13.42 | v83.08,26.09 82.24,23.99 v75.43,23.99
MOSI  (via drill 0.41)
  Top 0.203: v52.16,19.97 50.54,20.96 48,23.5 47.41,24.85 48.81,26.37 IC2.12 | v78.78,30.87 77.11,31 IC1.5
  Bottom 0.203: v52.16,19.97 52.59,20.53 53.53,21.17 54.7,20.63 | 54.7,20.63 54.32,19.24 52.57,18.35 | ISP1.4 40.07,5.85 | v78.78,30.87 78,30.72 75.28,30.34 72.48,27.8 61.82,27.8 | 55.21,21.07 54.75,20.68 54.7,20.63
  Bottom 0.254: 40.07,5.85 43.81,10.3 46.35,11.95 52.57,18.35 | 55.21,21.07 61.82,27.8
N$1
  Top 0.61: LED1.A 96.64,58.56 R1.1
N$2  (via drill 0.41)
  Top 0.305: USB1.D- 90.04,39.38 v88.89,38.87 | v86.48,38.49 R7.1
  Bottom 0.305: v88.89,38.87 v86.48,38.49
N$3  (via drill 0.41)
  Top 0.254: R7.2 v78.22,39.38 | v53.71,34.68 49.01,34.93 47.36,34.55 46.22,32.77 IC2.4
  Bottom 0.254: v78.22,39.38 73.14,40.14 69.46,39.25 66.16,34.81 59.94,34.3 v53.71,34.68
N$4  (via drill 0.41, 0.5)
  Top 0.254: IC2.5 46.98,32.39 47.87,33.79 49.14,34.17 52.44,33.92 v53.46,33.28 | v79.75,40.65 R8.2
  Bottom 0.254: v53.46,33.28 58.67,33.54 66.54,33.41 70.1,38.49 73.14,39.25 79.62,37.47 v79.75,40.65
N$5  (via drill 0.41)
  Top 0.305: R8.1 v86.48,40.78 | v89.15,40.27 USB1.D+
  Bottom 0.305: v86.48,40.78 v89.15,40.27
N$6
  Top 0.406: JP25.2 6.98,62.87 6.09,58.43 Q3.2
N$7  (via drill 0.41)
  Top 0.203: v43.38,24.19 47.13,27.95 IC2.9
  Bottom 0.203: v43.38,24.19 42.21,23.02 40.99,23.02 JP34.1
N$8
  Top 0.203: F2.1 86.25,42.48 87.32,41.41 87.7,41.41 87.83,40.65 87.83,39.73 87.72,37.42 89.91,37.68 90.47,38.36 91.69,38.36 91.89,38.67 USB1.VUSB
N$9
  Top 0.203: IC2.7 45.97,29.22 43.76,27.26 43.4,26.98 42.16,27.11 41.55,27.01 41.19,26.73 C11.2
N$10
  Top 0.203: R17.2 92.96,18.8 89.65,19.57 91.05,19.31 90.67,21.09 U1.CD1
N$11  (via drill 0.41)
  Top 0.203: 76.45,17.89 75.99,18.35 73.83,19.21 73.6,21.09 | 73.22,27.64 72.51,30.49 71.82,30.69 71.26,30.69 70.96,31 IC1.12 | R16.1 76.45,13.37 v76.55,13.37 | v91.1,9.97 91.13,10.73 89.53,12.71 v85.03,12.63
  Top 0.254: 76.45,13.37 76.45,17.89 | 73.6,21.09 73.22,27.64
  Bottom 0.203: v91.1,9.97 91.28,10.78 96.46,10.78 97.68,9.56 RF1.CSN | 85.06,12.4 v85.03,12.63 | v76.55,13.37 77.51,12.4
  Bottom 0.254: 77.51,12.4 85.06,12.4
N$12  (via drill 0.41)
  Top 0.203: R15.1 77.61,21.14 77.61,22.82 75.18,25.26 75.18,25.81 76.8,27.44 77.06,27.19 IC1.2 77.16,27.14 77.36,26.93 78.02,26.93 78.12,27.08 v79.29,27.49 | v95.98,31.28 97.05,29.45 98.39,29.07 U1.2-CD | v85.26,27.75 82.42,27.62 v81.98,27.69
  Bottom 0.203: v95.98,31.28 96.26,28.63 94.61,27.44 v85.26,27.75 | v81.98,27.69 81.78,27.49 v79.29,27.49
N$13  (via drill 0.41)
  Top 0.203: v95.06,30.11 96.26,29.04 97.17,28.41 97.63,27.95 98.39,27.95 U1.3-CMD | v85.64,30.95 85.77,29.02 84.52,28.41 80.31,28.41 | 80.31,28.41 79.75,28.41 78.53,29.62 77.21,29.62 77.11,29.73 IC1.4 | RF1.MOSI 97.68,7.02 97.63,7.02 96.61,8.03 96.44,8.29 95.6,8.24 93.97,8.24 93.36,9.61 92.98,10.12 89.81,13.67 89.68,16.9 85.84,20.46 82.57,22.23 80.79,25.08 80.31,28.35 80.31,28.41
  Bottom 0.203: v95.06,30.11 93.97,30.95 v85.64,30.95
N$14  (via drill 0.41)
  Top 0.203: v75.25,32.8 73.75,33.41 70.96,33.54 IC1.10 | v81.04,32.62 85.11,32.62 86.61,31.38 v86.23,26.45 | v86.81,22.82 88.33,21.29 88.33,20 90.21,17.74 91.23,13.75 94.28,9.81 94.89,9.81 95.14,9.56 RF1.CE
  Bottom 0.203: v75.25,32.8 75.43,32.62 v81.04,32.62 | v86.23,26.45 85.59,25.94 85.74,25.21 86,23.83 87.57,22.26 v86.81,22.82
N$16
  Top 0.203: 29,24.04 29,25.1 D2.C | 21.94,11.9 C5.1 22.04,11.95 25.29,11.95 26.92,13.57 27.63,12.86 IC4.3 28.49,12.1 28.49,10.3 | 54.7,1.13 57.75,1.89 57.9,3.31 57.9,4.33 58.67,5.09 67.3,5.09 67.76,4.63 70.71,7.58 73.91,7.58 75.43,6.05 76.55,7.17 79.39,7.17 IC3.3 | 34.56,1.25 34.31,2.4 34.31,3.87
  Top 0.254: 21.94,11.9 19.91,14.56 | 34.56,1.25 54.7,1.13 | 34.31,3.87 31.67,7.02 28.49,10.3
  Top 0.305: 19.91,14.56 29,24.04
N$17  (via drill 0.41)
  Top 0.203: 96.97,25.76 98.39,25.76 U1.5-CLK | 96.97,25.76 95.78,27.21 v94.89,28.84 | v84.83,29.47 81.32,29.47 79.09,31.71 78.99,31.71 78.53,32.16 77.21,32.16 77.11,32.27 IC1.6 | v96.87,25.66 96.97,25.76
  Bottom 0.203: v94.89,28.84 93.11,29.47 v84.83,29.47 | v96.87,25.66 96.87,14.69 98.65,12.91 98.9,12.91 98.9,9.05 98.19,8.34 96.51,8.34 95.19,7.02 RF1.SCK
NRF-IRQ  (via drill 0.41)
  Top 0.203: v61.08,17.59 54.25,24.54 54.25,24.7 IC2.18 | v88.74,6.31 91.97,6.43 94.3,2.7 95.9,2.7 97.68,4.48 RF1.IRQ
  Top 0.254: v66.26,17.69 v75.84,7.48
  Bottom 0.203: v61.08,17.59 63.64,18.07 v66.26,17.69 | v75.84,7.48 76.24,7.07
  Bottom 0.254: 76.24,7.07 85.21,6.87 v88.74,6.31
PB0-SD-SS  (via drill 0.41)
  Top 0.203: v46.07,25.87 47.69,27.49 IC2.10 | v51.12,29.78 v53.05,31.71 | v72.87,31.2 74.47,28.08 77.06,28.46 IC1.3 | JP14.6 70.86,41.36 v71.9,38.03
  Bottom 0.203: v46.07,25.87 50.23,30.03 v51.12,29.78 | 66.9,31.2 v72.87,31.2 | v53.05,31.71 66.9,31.2 | v71.9,38.03 71.49,36.84 66.9,31.25 66.9,31.2
PB4  (via drill 0.41)
  Top 0.203: v51.76,22.79 50.69,22.97 49.47,23.86 49.32,24.65 49.93,25.26 IC2.14 | 46.17,14.33 v45.53,16.62 | 52.62,7.88 52.62,7.07 52.82,6.87 52.82,5.7 53.08,5.44 53.08,4.83 JP13.9
  Top 0.254: 52.62,7.88 46.17,14.33
  Bottom 0.203: v51.76,22.79 48.63,19.82 47.49,19.95 46.09,18.68 46.17,17.84 v45.53,16.62
PC0-NRF-CE  (via drill 0.41)
  Top 0.203: v60.06,35.19 61,36.13 61,36.28 IC2.35 | v67,37.85 70.25,34.86 70.71,34.6 70.91,34.81 IC1.9
  Bottom 0.203: 60.75,35.31 64.89,35.95 v67,37.85 | v60.06,35.19 60.75,35.31 | JP14.7 65.83,44.76 65.83,43.09 65.73,43.09 60.75,38.11 60.75,35.31
PC1-NRF-CSN  (via drill 0.41)
  Top 0.203: v61.97,38.16 60.7,36.89 60.44,36.89 IC2.36 | v65.75,40.34 66.03,37.6 67.05,33.41 69,33.16 70.91,32.27 IC1.11
  Bottom 0.203: v61.97,38.16 62.27,38.46 64.99,38.59 | 64.99,38.59 68.78,43.65 68.78,45.42 68.83,45.42 69.64,46.24 JP14.5 | 64.99,38.59 v65.75,40.34
PC2
  Top 0.203: JP14.10 64.91,43.54 64.66,42.55 64.81,42.4 59.88,37.6 59.88,37.45 IC2.37
PD0-SCL  (via drill 0.41)
  Top 0.203: v62.68,23.68 58.21,28.66 IC2.25 | v46.3,8.82 v48.45,10.6
  Bottom 0.203: v62.68,23.68 61.94,23.2 61.13,22.18 49.17,10.73 v48.45,10.6 | v46.3,8.82 45.41,8.19 43.17,8.19 41.9,6.92 40.76,5.09 41.9,3.82 JP13.1
PD1-SDA  (via drill 0.41)
  Top 0.203: v61.51,26.35 59.83,28.15 59.83,28.25 58.87,29.22 58.77,29.22 IC2.26 | v45.2,9.99 45.2,5.09 JP13.3
  Bottom 0.203: v61.51,26.35 61.13,25.56 54.8,18.73 51.78,16.57 46.47,11.06 v45.2,9.99
PD2-RX1  (via drill 0.41)
  Top 0.203: v62.35,25.54 62.22,26.78 59.33,29.68 59.33,29.78 IC2.27 | v47.49,8.57 47.54,7.88 47.54,7.07 47.74,6.87 47.74,5.09 JP13.5 | v79.95,23.15 79.82,23.22 | 88.13,14.03 BLUETOOTH.TX
  Top 0.305: 79.82,23.22 88.13,14.03
  Bottom 0.203: v47.49,8.57 47.24,10.78 52.11,15.91 53.99,17.18 62.17,25.23 62.3,25.36 v62.35,25.54 62.27,25.71 62.27,25.97 63.31,27.14 65.55,27.26
  Bottom 0.254: v79.95,23.15 69.92,23.15 65.55,27.26
PD3-TX1  (via drill 0.41)
  Top 0.203: 63.85,23.83 v65.65,22.16 | 63.85,23.83 63.39,24.29 63.39,24.49 63.44,24.7 63.19,25.84 63.01,26.27 62.75,26.98 61,28.99 60.75,29.17 59.88,30.03 59.88,30.34 IC2.28 | JP13.7 51.55,4.58 50.28,5.85 50.28,6.87 50.69,7.27 v49.45,9.15 | v62.42,22.41 63.85,23.83
  Bottom 0.203: v65.65,22.16 66.23,22.49 | 88.13,16.42 BLUETOOTH.RX | v49.45,9.15 62.3,22.13 v62.42,22.41
  Bottom 0.254: 66.23,22.49 77.26,22.49 83.71,16.42 88.13,16.42
PD4-SD-CD  (via drill 0.41)
  Top 0.203: v61.99,29.22 60.44,30.89 IC2.29 | v79.9,31.91 79.95,33.23 80.33,33.56 81.78,33.61 88.66,33.87 87.47,32.52 U1.CD2
  Bottom 0.203: v61.99,29.22 64.51,29.45 73.27,29.45 75.99,31.91 v79.9,31.91
PD5  (via drill 0.41)
  Top 0.203: v64,26.3 62.96,27.72 62.96,29.4 61.05,31.3 61.05,31.45 IC2.30 | 52.88,12.71 v51.86,14.44 | JP13.14 59.17,6.41
  Top 0.254: 59.17,6.41 52.88,12.71
  Bottom 0.203: v64,26.3 63.36,25.15 62.09,24.32 56.15,18.35 v51.86,14.44
PD6  (via drill 0.41)
  Top 0.203: v65.75,23.71 64.74,24.6 64.86,27.03 63.75,28.53 63.36,29.73 62.86,30.36 62.48,30.89 61.61,31.76 61.61,32.01 IC2.31 | v55.87,13.27 56.38,11.74 61.71,6.41 JP13.16
  Bottom 0.203: v65.75,23.71 64.94,22.77 64.56,21.8 62.75,20.66 v55.87,13.27
PD7  (via drill 0.41)
  Top 0.203: 63.97,30.08 62.68,32.01 62.17,32.62 IC2.32 | 65.04,28.51 65.47,27.44 65.98,25.56 v65.78,25 | v56.58,15.12 57.09,13.57 64.25,6.41 JP13.18
  Top 0.305: 65.04,28.51 63.97,30.08
  Bottom 0.203: v65.78,25 64.41,23.5 64.03,22.21 62.02,20.81 v56.58,15.12
PE0  (via drill 0.41)
  Top 0.203: v64.03,39.86 63.77,38.46 64.79,37.45 62.17,35.21 IC2.33
  Bottom 0.203: v64.03,39.86 67.3,43.65 JP14.8
PE1  (via drill 0.41)
  Top 0.203: v63.09,37.24 61.61,35.77 IC2.34
  Bottom 0.203: v63.09,37.24 63.44,37.6 65.27,37.6 71.31,43.65 71.31,45.42 71.37,45.42 72.18,46.24 JP14.3
PE5  (via drill 0.41)
  Top 0.203: v57.7,32.57 53.26,28.13 53.89,26.48 54.75,25.61 54.75,25.31 IC2.19 | v70.68,37.35 70.6,38.87 v69.72,40.52
  Bottom 0.203: v57.7,32.57 58.64,32.75 66.72,32.24 v70.68,37.35 | v69.72,40.52 72.33,43.7 JP14.4
SCLK  (via drill 0.41)
  Top 0.203: 45.03,23.71 44.44,22.61 v44.82,20.96 | 45.03,23.71 48.25,26.93 IC2.11 | v72.79,37.22 75.18,34.7 75.18,34.1 75.73,33.54 77.06,33.54 IC1.7 | v68.75,32.16 68.62,30.34 v68.42,28.74 | v55.01,22.13 55.52,19.9 52.95,17.33 49.57,19.57 48.15,20.07 45.03,23.71
  Bottom 0.203: 38.35,13.6 37.08,11.01 36.16,10.12 35.09,9.05 35.48,7.25 35.81,6.61 36.57,5.85 ISP1.3 | v68.75,32.16 v72.79,37.22 | v68.42,28.74 66.74,28.46 61.46,28.46 v55.01,22.13
  Bottom 0.254: 38.35,13.6 v44.82,20.96
VCC  (3 unrouted)
  Top 0.203: 11.47,62.19 11.47,62.75 P1.VMOT 11.52,62.14 11.52,62.09 | 29,31.05 29,29.88 D2.A 29,29.78 29.1,29.68 | 24.17,35.87 F3.2 | C7.1 23.16,23.73 | 26.87,55.33 26.66,55.33 | 28.06,54.18 27.83,54.36
  Top 0.61: F3.2 C12.1 28.06,46.87 27.93,50.94 26.79,52.33 27.8,53.86 28.06,54.18 C2.1 31.49,58.3 P2.VMOT | 29,31.05 24.17,35.87 | 23.16,23.73 29.1,29.68 | 11.52,62.09 13.05,60.56 21.43,60.56 26.66,55.33 | 27.83,54.36 26.87,55.33 | 10.46,58.23 10.91,59.7 P1.VMOT | JP6.1 P4.VMOT 71.75,58.43 C4.1 69.46,55.13 64.38,55 62.22,59.7 57.02,60.21 54.35,59.83 P3.VMOT | P3.VMOT JP4.1 | P3.VMOT 52.7,58.43 C3.1 49.52,58.81 40.5,60.46 33.52,60.46 P2.VMOT | P2.VMOT JP2.1
  Bottom 0.203: P1.VMOT | P1.VMOT 11.37,62.7 | P1.VMOT 11.37,62.59 | 11.17,61.43 11.37,61.43
  pour Top (isolate 0.305, rank 2): 10.66,63.89 10.53,61.1 9.39,59.57 9.39,57.54 9.64,56.14 10.66,56.14 14.22,52.59 21.07,53.86 21.71,52.71 22.73,52.33 24.63,51.57 26.66,45.47 25.52,42.3 18.53,36.33 18.53,31.25 18.28,31 21.84,19.57 31.49,23.63 33.27,32.52 36.57,41.54 38.09,47.63 44.82,53.35 44.82,55.51 51.55,54.87 51.55,55.38 57.14,54.11 65.27,54.11 70.86,54.87 70.86,55.38 74.03,60.21 74.03,67.83 74.16,69.86 15.74,69.86 14.22,67.7 13.58,64.91
X-DIR  (via drill 0.41)
  Top 0.203: v42.49,48.47 42.77,48.07 45.99,48.19 46.17,48.27 47.29,48.27 49.67,45.88 49.67,44.26 50.54,43.39 50.54,43.14 IC2.50 | v31.59,48.42 31.29,48.62 29.71,49.69 29.61,49.69 29.25,50.05 P1.DIR
  Bottom 0.203: v42.49,48.47 42.56,48.42 v31.59,48.42
X-MOT-1A
  Bottom 1.778: P1.1A JP1.3
X-MOT-1B
  Bottom 1.778: P1.1B JP1.4
X-MOT-2A
  Bottom 1.778: P1.2A JP1.2
X-MOT-2B
  Bottom 1.778: P1.2B JP1.1
X-MS1
  Top 0.203: P1.MS1 12.13,51.88 R2.1 12.18,52.64 12.18,52.79 14.47,55.08 14.47,55.74 16.1,57.36 15.74,57.72 JP27.2
X-MS2
  Top 0.203: P1.MS2 16.55,50.05 16.55,53.35 17.47,54.26 17.01,54.72 17.01,56.45 18.28,57.72 JP27.4
X-MS3
  Top 0.203: P1.MS3 19.09,50.05 19.09,53.35 20.01,54.26 19.55,54.72 19.55,56.45 20.82,57.72 JP27.6
X-RESETSLEEP
  Bottom 0.254: P1.!RST P1.!SLP
X-STEP  (via drill 0.41)
  Top 0.203: 45.71,47.43 v45.84,47.3 47.39,47.3 48.94,45.75 49.06,43.7 49.93,42.83 49.93,42.58 IC2.51
  Top 0.254: v29.33,48.34 v37.02,41.16
  Bottom 0.203: v45.84,47.3 44.85,47.2 43.35,47.2 | v37.02,41.16 37.43,41.16 | v29.33,48.34 28.26,48.55 27.04,48.8 26.81,50.05 P1.STEP
  Bottom 0.254: 37.43,41.16 43.35,47.2
X-STOP  (via drill 0.41)
  Top 0.203: v51.83,26.37 50.59,24.75 IC2.15
  Bottom 0.203: v51.83,26.37 48.81,22.97 44.7,22.97 28.08,7.37 20.36,7.37 19.4,6.41 19.4,4.58 19.35,4.58 18.53,3.77 18.33,3.77 JP35.1
XTAL1  (via drill 0.41)
  Top 0.203: v64.76,20.84 61.97,20.84 57.75,28.1 57.65,28.1 IC2.24 | v68.27,21.22 69.69,19.92 XTAL1.1 69.79,19.97 72.64,17.13 72.64,16.72 C15.1
  Bottom 0.203: v64.76,20.84 v68.27,21.22
XTAL2
  Top 0.203: IC2.23 57.09,27.49 57.09,27.34 58.13,26.04 58.64,22.06 62.04,18.91 62.09,17.41 60.57,15.5 61.92,14.18 62.93,13.17 XTAL1.2 62.98,13.17 64.31,11.84 68.06,11.84 C8.1
Y-DIR
  Top 0.203: IC2.48 53.69,43.7 53.99,44 53.94,45.2 53.18,46.39 P2.DIR
Y-MOT-1A
  Bottom 1.778: P2.1A JP3.3
Y-MOT-1B
  Bottom 1.778: P2.1B JP3.4
Y-MOT-2A
  Bottom 1.778: P2.2A JP3.2
Y-MOT-2B
  Bottom 1.778: P2.2B JP3.1
Y-MS1
  Top 0.203: P2.MS1 31.95,52.38 31.95,52.59 R3.1 32,52.64 32,55.58 34.18,57.77 34.23,57.72 JP9.2
Y-MS2
  Top 0.203: P2.MS2 36.87,50.05 36.87,53.35 35.55,54.67 35.55,56.5 36.77,57.72 JP9.4
Y-MS3  (via drill 0.41)
  Top 0.203: v40.48,52.33 40.43,52.33 38.09,54.67 38.09,56.5 39.31,57.72 JP9.6
  Bottom 0.203: v40.48,52.33 40.48,51.11 39.41,50.05 P2.MS3
Y-RESETSLEEP
  Bottom 0.203: P2.!RST P2.!SLP
Y-STEP
  Top 0.203: 51.05,45.63 51.15,43.7 IC2.49 | 47.18,49.49 47.18,49.89 47.03,50.05 P2.STEP
  Top 0.254: 51.05,45.63 47.18,49.49
Y-STOP  (via drill 0.41)
  Top 0.203: v53.48,20.07 53.26,20.43 53.13,20.53 52.77,21.65 52.9,21.78 52.85,22.72 52.09,23.73 51.15,24.04 51.15,24.14 IC2.16 | v36.36,12.3 v42.87,12.3
  Bottom 0.203: v53.48,20.07 45.71,12.3 v42.87,12.3 | v36.36,12.3 30.32,6.26 28.19,6.26 24.02,2.09 22.6,2.09 20.97,3.72 20.87,3.72 JP35.3
Z-DIR  (via drill 0.41)
  Top 0.203: 54.96,42.58 54.8,42.58 IC2.46 | v67.76,48.07 69.79,50.1 P3.DIR
  Top 0.254: 54.96,42.58 v56.76,45.02
  Bottom 0.203: 60.39,48.01 67.71,48.01 v67.76,48.07
  Bottom 0.254: v56.76,45.02 60.39,48.01
Z-MOT-1A
  Bottom 1.778: P3.1A JP5.3
Z-MOT-1B
  Bottom 1.778: P3.1B JP5.4
Z-MOT-2A
  Bottom 1.778: P3.2A JP5.2
Z-MOT-2B
  Bottom 1.778: P3.2B JP5.1
Z-MS1
  Top 0.203: P3.MS1 52.27,52.38 52.27,52.59 R4.1 52.32,52.64 52.32,53.96 55.97,57.62 55.62,57.97 JP10.2
Z-MS2
  Top 0.203: P3.MS2 57.19,50.05 57.19,52.54 56.38,53.35 56.38,54.47 56.89,54.97 56.89,56.75 58.11,57.97 JP10.4
Z-MS3
  Top 0.203: P3.MS3 59.73,50.05 59.73,54.62 59.43,54.92 59.43,56.75 60.65,57.97 JP10.6
Z-RESETSLEEP
  Bottom 0.203: P3.!RST P3.!SLP
Z-STEP  (via drill 0.41)
  Top 0.203: v55.19,45.75 55.24,44.33 54.25,43.29 54.25,43.14 IC2.47
  Bottom 0.203: 59.63,48.67 65.96,48.67 67.58,50.3 P3.STEP
  Bottom 0.254: v55.19,45.75 59.63,48.67
Z-STOP  (via drill 0.41)
  Top 0.203: v48.25,21.88 52.77,18.25 54.55,20.02 53.79,22.69 53.69,23.94 53.69,24.14 IC2.17
  Bottom 0.203: v48.25,21.88 48.3,21.8 44.9,22.18 29.76,6.92 26.36,6.66 23.46,3.77 23.41,3.77 JP35.5

## Text on the board
_tsilk: +12V | FAN | X-MOTOR | 12V PWR | Y-MOTOR | 12V PWR | Z-MOTOR | 12V PWR | E-MOTOR | 2B | 2A | 1A | 1B | GND | +12V | 2B | 2A | 1A | 1B | GND | +12V | 2B | 2A | 1A | 1B | GND | +12V | 2B | 2A | 1A | 1B | LED1 | C1 | C2 | C3 | + | + | + | + | 5v | 5v | 5v | R1 180 | 22k | MS1 | MS2 | MS3 | 5v | R3 | 22k | MS1 | MS2 | MS3 | R4 | 56k | MS1 | MS2 | MS3 | R5 | 22k | MS1 | MS2 | MS3 | Q3 | R2 | RESET | FAN | S1 | 12V | X-Axis | Y-Axis | C16 4.7uF | Z-Axis | Extruder | F2 500ma | C13 | + | - | 3.3V | GND | SCREW | 12V | .1uF | ATX+4 | F3 | C14 | PC2 | 5V | + | PC0 | .1uF | PC1 | PE1 | PE0 | PE5 | GND | C12 580uF | PB0 | 22 | GND | R12 22k | 22 | USB Mini5 | AT90USB | IC1 4050D | -V | Hot Bed | +12V | R11 22k | D2 | Q2 | C7 580uF | 1k | uSD | C9 10uF | + | Bed | R10 4.7k | Therm. | 1k | PE3 | -V | R14 22k | ALE | R15 22k | LRC v.9 | R17 22k | R6 22K | XTAL 16Mhz | Bluetooth | +12V | 22pF | IC4 5v | R16 22k | C10 10uF | + | C5 .33uF | ISP | Q1 | 5V | 22pF | Hot End | R9 4.7K | A1 | A3 | A5 | PD6 | X Y Z | A0 | A2 | A4 | PD5 | PD7 | GND | GND | + | nRF24L01 | SIG | Ext | Therm. | C6 .1uF | IC3 3.3v | Endstops | GND | SCL | SDA | RX1 | TX1 | PB4 | 5V | 5V | 3.3V | GND | GND | C17 .1uF